# EAGLE schematic Usilok (EAGLE 6.4)
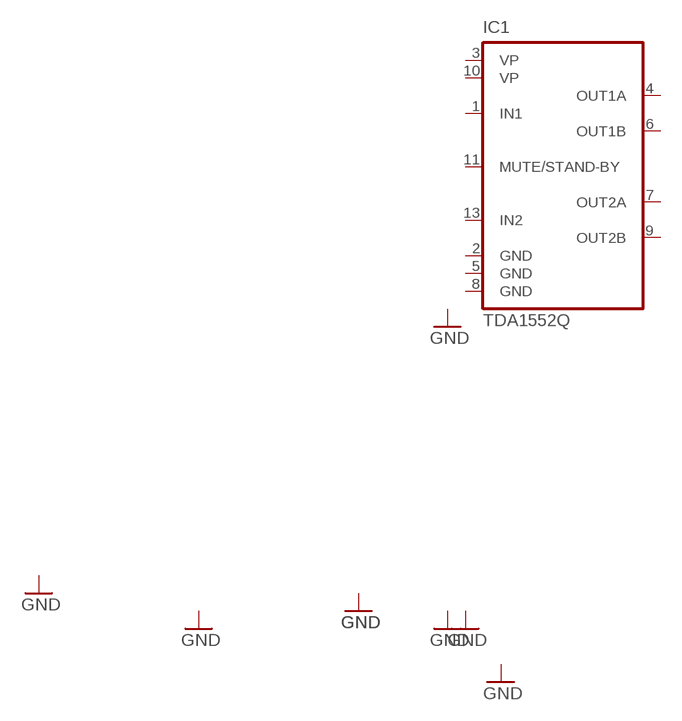
[diagram p0: schematic, sheet 1]

## Parts
IC1  TDA1552Q  [MULTIWAT-SIL13]
Unconnected: IC1.1(IN1) IC1.3(VP) IC1.4(OUT1A) IC1.6(OUT1B) IC1.7(OUT2A) IC1.9(OUT2B) IC1.10(VP) IC1.11(MUTE/STAND-BY) IC1.13(IN2)

## Power pins joined to a net without a drawn wire
GND: IC1.2(GND) IC1.5(GND) IC1.8(GND)

## Library data of the parts
IC1 = philips-semiconductors:TDA1552Q: 2 x 22 W BTL stereo car radio power amplifier Source: Data sheet <http://www.nxp.com/documents/data_sheet/TDA1552Q_CNV.pdf>